# Altium schematic sheet FPGA_MGT.SchDoc
size 420 x 297 mm; SheetNumber: 17; SheetTotal: 18; ModifiedBy: -; CheckedDate: -; Title2: Title 2; DivGrp: WUT ISE; Designer: G.Kasprowicz
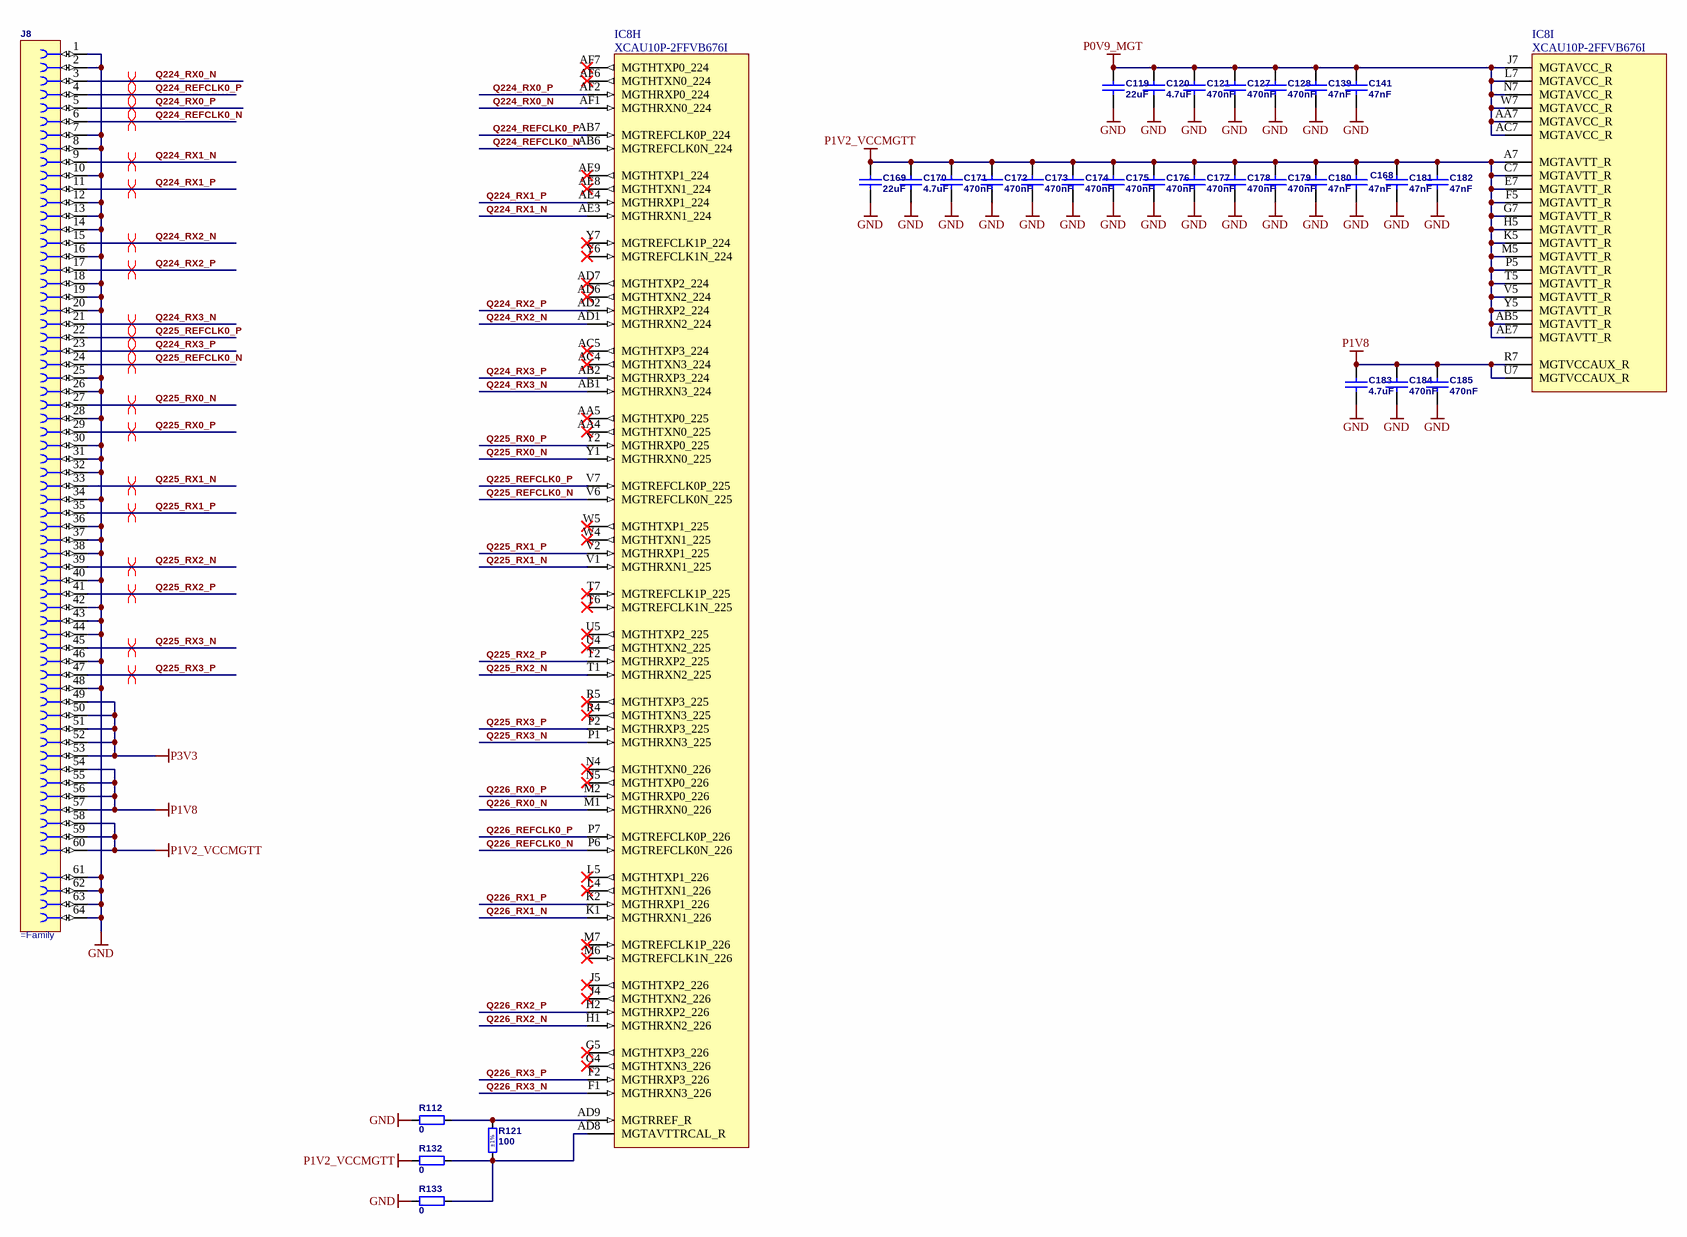
[diagram p0: FPGA_MGT.SchDoc]

## Parts
C119  22uF  [CAPC1608X90N]
C120  4.7uF  [CAPC2012X135N]
C121  470nF  [CAPC1005X55N]
C127  470nF  [CAPC1005X55N]
C128  470nF  [CAPC1005X55N]
C139  47nF  [CAPC1005X55N]
C141  47nF  [CAPC1005X55N]
C168  47nF  [CAPC1005X55N]
C169  22uF  [CAPC1608X90N]
C170  4.7uF  [CAPC2012X135N]
C171  470nF  [CAPC1005X55N]
C172  470nF  [CAPC1005X55N]
C173  470nF  [CAPC1005X55N]
C174  470nF  [CAPC1005X55N]
C175  470nF  [CAPC1005X55N]
C176  470nF  [CAPC1005X55N]
C177  470nF  [CAPC1005X55N]
C178  470nF  [CAPC1005X55N]
C179  470nF  [CAPC1005X55N]
C180  47nF  [CAPC1005X55N]
C181  47nF  [CAPC1005X55N]
C182  47nF  [CAPC1005X55N]
C183  4.7uF  [CAPC2012X135N]
C184  470nF  [CAPC1005X55N]
C185  470nF  [CAPC1005X55N]
IC8  XCAU10P-2FFVB676I  [BGA676C100P26X26_2700X2700X350]  (parts H,I of 13)
J8  (no value)  [SAMTEC_QSH-030-01-L-D-A]
R112  0  [RESC1005X40N]
R121  100  Tolerance: ±1%  [RESC1005X40N]
R132  0  [RESC1005X40N]
R133  0  [RESC1005X40N]

## Nets
GND: C119.1 C120.1 C121.1 C127.1 C128.1 C139.1 C141.1 C168.1 C169.1 C170.1 C171.1 C172.1 C173.1 C174.1 C175.1 C176.1 C177.1 C178.1 C179.1 C180.1 C181.1 C182.1 C183.1 C184.1 C185.1 J8.1 J8.2 J8.7 J8.8 J8.10 J8.12 J8.13 J8.14 J8.16 J8.18 J8.19 J8.20 J8.25 J8.26 J8.28 J8.30 J8.31 J8.32 J8.34 J8.36 J8.37 J8.38 J8.40 J8.42 J8.43 J8.44 J8.46 J8.48 J8.61 J8.62 J8.63 J8.64 R112.1 R133.1
P0V9_MGT: C119.2 C120.2 C121.2 C127.2 C128.2 C139.2 C141.2 IC8.AA7(MGTAVCC_R) IC8.AC7(MGTAVCC_R) IC8.J7(MGTAVCC_R) IC8.L7(MGTAVCC_R) IC8.N7(MGTAVCC_R) IC8.W7(MGTAVCC_R)
P1V2_VCCMGTT: C168.2 C169.2 C170.2 C171.2 C172.2 C173.2 C174.2 C175.2 C176.2 C177.2 C178.2 C179.2 C180.2 C181.2 C182.2 IC8.A7(MGTAVTT_R) IC8.AB5(MGTAVTT_R) IC8.AE7(MGTAVTT_R) IC8.C7(MGTAVTT_R) IC8.E7(MGTAVTT_R) IC8.F5(MGTAVTT_R) IC8.G7(MGTAVTT_R) IC8.H5(MGTAVTT_R) IC8.K5(MGTAVTT_R) IC8.M5(MGTAVTT_R) IC8.P5(MGTAVTT_R) IC8.T5(MGTAVTT_R) IC8.V5(MGTAVTT_R) IC8.Y5(MGTAVTT_R) J8.58 J8.59 J8.60 R132.1
P1V8: C183.2 C184.2 C185.2 IC8.R7(MGTVCCAUX_R) IC8.U7(MGTVCCAUX_R) J8.54 J8.55 J8.56 J8.57
P3V3: J8.49 J8.50 J8.51 J8.52 J8.53
Q224_REFCLK0_N: IC8.AB6(MGTREFCLK0N_224) J8.6
Q224_REFCLK0_P: IC8.AB7(MGTREFCLK0P_224) J8.4
Q224_RX0_N: IC8.AF1(MGTHRXN0_224) J8.3
Q224_RX0_P: IC8.AF2(MGTHRXP0_224) J8.5
Q224_RX1_N: IC8.AE3(MGTHRXN1_224) J8.9
Q224_RX1_P: IC8.AE4(MGTHRXP1_224) J8.11
Q224_RX2_N: IC8.AD1(MGTHRXN2_224) J8.15
Q224_RX2_P: IC8.AD2(MGTHRXP2_224) J8.17
Q224_RX3_N: IC8.AB1(MGTHRXN3_224) J8.21
Q224_RX3_P: IC8.AB2(MGTHRXP3_224) J8.23
Q225_REFCLK0_N: IC8.V6(MGTREFCLK0N_225) J8.24
Q225_REFCLK0_P: IC8.V7(MGTREFCLK0P_225) J8.22
Q225_RX0_N: IC8.Y1(MGTHRXN0_225) J8.27
Q225_RX0_P: IC8.Y2(MGTHRXP0_225) J8.29
Q225_RX1_N: IC8.V1(MGTHRXN1_225) J8.33
Q225_RX1_P: IC8.V2(MGTHRXP1_225) J8.35
Q225_RX2_N: IC8.T1(MGTHRXN2_225) J8.39
Q225_RX2_P: IC8.T2(MGTHRXP2_225) J8.41
Q225_RX3_N: IC8.P1(MGTHRXN3_225) J8.45
Q225_RX3_P: IC8.P2(MGTHRXP3_225) J8.47
Q226_REFCLK0_N: IC8.P6(MGTREFCLK0N_226)
Q226_REFCLK0_P: IC8.P7(MGTREFCLK0P_226)
Q226_RX0_N: IC8.M1(MGTHRXN0_226)
Q226_RX0_P: IC8.M2(MGTHRXP0_226)
Q226_RX1_N: IC8.K1(MGTHRXN1_226)
Q226_RX1_P: IC8.K2(MGTHRXP1_226)
Q226_RX2_N: IC8.H1(MGTHRXN2_226)
Q226_RX2_P: IC8.H2(MGTHRXP2_226)
Q226_RX3_N: IC8.F1(MGTHRXN3_226)
Q226_RX3_P: IC8.F2(MGTHRXP3_226)
NetIC8_AD8: IC8.AD8(MGTAVTTRCAL_R) R121.2 R132.2 R133.2
NetIC8_AD9: IC8.AD9(MGTRREF_R) R112.2 R121.1

Not connected (* = marked no-connect by the designer): IC8 AA4(MGTHTXN0_225)* AA5(MGTHTXP0_225)* AC4(MGTHTXN3_224)* AC5(MGTHTXP3_224)* AD6(MGTHTXN2_224)* AD7(MGTHTXP2_224)* AE8(MGTHTXN1_224)* AE9(MGTHTXP1_224)* AF6(MGTHTXN0_224)* AF7(MGTHTXP0_224)* G4(MGTHTXN3_226)* G5(MGTHTXP3_226)* J4(MGTHTXN2_226)* J5(MGTHTXP2_226)* L4(MGTHTXN1_226)* L5(MGTHTXP1_226)* M6(MGTREFCLK1N_226)* M7(MGTREFCLK1P_226)* N4(MGTHTXN0_226)* N5(MGTHTXP0_226)* R4(MGTHTXN3_225)* R5(MGTHTXP3_225)* T6(MGTREFCLK1N_225)* T7(MGTREFCLK1P_225)* U4(MGTHTXN2_225)* U5(MGTHTXP2_225)* W4(MGTHTXN1_225)* W5(MGTHTXP1_225)* Y6(MGTREFCLK1N_224)* Y7(MGTREFCLK1P_224)*

## Layout directives
differential pair: Q224_REFCLK0_N, Q224_REFCLK0_P, Q224_RX0_N, Q224_RX0_P, Q224_RX1_N, Q224_RX1_P, Q224_RX2_N, Q224_RX2_P, Q224_RX3_N, Q224_RX3_P, Q225_REFCLK0_N, Q225_REFCLK0_P, Q225_RX0_N, Q225_RX0_P, Q225_RX1_N, Q225_RX1_P, Q225_RX2_N, Q225_RX2_P, Q225_RX3_N, Q225_RX3_P

## Notes on the sheet
- Project/Equipment
- Document
- Designer
- Drawn by
- Check.by
- Copyright WUT ISE 2024.
  This documentation describes Open Hardware and is licensed under the CERN OHL v.2. You may redistribute and modify this documentation under the terms of the CERN OHL v.2. (http://ohwr.org/CERNOHL). This documentation is distributed WITHOUT ANY EXPRESS OR IMPLIED WARRANTY, INCLUDING OF MERCHANTABILITY, SATISFACTORY QUALITY AND FITNESS FOR A PARTICULAR PURPOSE. Please see the CERN OHL v.2 for applicable conditions.
- Contact
- File
- Last Mod.
- Print Date
- Sheet
- Size
- A3
- of
- Rev

## Library data of the parts
C119 C169 = CC0603_22UF_6.3V_20%_X5R: Non-polarised capacitor; Part Description: SMD Multilayer Chip Ceramic Capacitor; Manufacturer: GENERIC; Manufacturer1 Part Number: C1608X5R0J226M080; Voltage: 6.3V; TC: X5R; Tolerance: ±20%; Part Number: CC0603_22UF_6.3V_20%_X5R; Component Kind: Standard; Component Type: Standard; Pin Count: 2; Value: 22uF; Status: None; Manufacturer Part Number: CC0603_22UF_6.3V_20%_X5R; Case: 0603; Mounted: Yes; Socket: No; SMD: Yes; Sense: No; Manufacturer1 Example: TDK; Manufacturer1 ComponentHeight: 0.9mm; HelpURL: \\cern.ch\dfs\Applications\Altium\Datasheets\CC0603_X5R_TDK_C.pdf; Author: CERN DEM JLC; CreateDate: 16.12.2013; LatestRevisionDate: 03.12.2020
C120 C170 C183 = CC0805_4.7UF_16V_10%_X7R: Non-polarised capacitor; Part Description: SMD Multilayer Chip Ceramic Capacitor; Manufacturer: GENERIC; Manufacturer1 Part Number: EMK212B7475KG-T; Voltage: 16V; TC: X7R; Tolerance: ±10%; Part Number: CC0805_4.7UF_16V_10%_X7R; Component Kind: Standard; Component Type: Standard; Pin Count: 2; Value: 4.7uF; Status: Preferred; Manufacturer Part Number: CC0805_4.7UF_16V_10%_X7R; Case: 0805; Mounted: Yes; Socket: No; SMD: Yes; Sense: No; Manufacturer1 Example: TAIYO YUDEN; Manufacturer1 ComponentHeight: 1.35mm; HelpURL: \\cern.ch\dfs\Applications\Altium\Datasheets\CC0805_X7R_TAIYO-YUDEN_HIGH-VALUE.pdf; Author: CERN DEM JLC; CreateDate: 16.09.2014; LatestRevisionDate: 16.09.2014
C121 C127 C128 C171-C179 C184 C185 = CC0402_470NF_16V_10%_X5R: Non-polarised capacitor; Part Description: SMD Multilayer Chip Ceramic Capacitor; Manufacturer: GENERIC; Manufacturer1 Part Number: C1005X5R1C105KT; Voltage: 16V; TC: X5R; Tolerance: ±10%; Part Number: CC0402_470NF_16V_10%_X5R; Component Kind: Standard; Component Type: Standard; Pin Count: 2; Value: 470nF; Status: Preferred; Manufacturer Part Number: CC0402_470NF_16V_10%_X5R; Case: 0402; Mounted: Yes; Socket: No; SMD: Yes; Sense: No; Manufacturer1 Example: TDK; Manufacturer1 ComponentHeight: 0.55mm; HelpURL: \\cern.ch\dfs\Applications\Altium\Datasheets\CC0402_X5R_TDK_C.pdf; Author: CERN DEM JLC; CreateDate: 25.10.2012; LatestRevisionDate: 25.10.2012
C139 C141 C168 C180-C182 = CC0402_47NF_16V_10%_X7R: Non-polarised capacitor; Part Description: SMD Multilayer Chip Ceramic Capacitor; Manufacturer: GENERIC; Manufacturer1 Part Number: 223878715645; Voltage: 16V; TC: X7R; Tolerance: ±10%; Part Number: CC0402_47NF_16V_10%_X7R; Component Kind: Standard; Component Type: Standard; Pin Count: 2; Value: 47nF; Status: Not Recommended; Manufacturer Part Number: CC0402_47NF_16V_10%_X7R; Case: 0402; Mounted: Yes; Socket: No; SMD: Yes; Sense: No; Manufacturer1 Example: PHYCOMP; Manufacturer1 ComponentHeight: 0.55mm; HelpURL: \\cern.ch\dfs\Applications\Altium\Datasheets\CC0402_X7R_PHYCOMP.pdf; Author: CERN DEM JLC; CreateDate: 03.12.2007; LatestRevisionDate: 03.12.2007
IC8 = XCAU10P-2FFVB676I: Artix UltraScale + Field Programmable Gate Array (FPGA), 676-Pin BGA, Industrial Grade; Manufacturer: AMD; PressFit: No; Bonding: No; Part Number: XCAU10P-2FFVB676I; Component Kind: Standard; Component Type: Standard; Device: XCAU10P-2FFVB676I; PackageDescription: BGA, 1.00mm Pitch, Square; 672 Pin, 26 Columns X 26 Rows, Body 27.00mm X 27.00mm X 3.50mm H, IPC Medium Density; Part Description: Artix UltraScale + Field Programmable Gate Array (FPGA), 676-Pin BGA, Industrial Grade; Manufacturer Part Number: XCAU10P-2FFVB676I; Pin Count: 676; Case: BGA676; Mounted: Yes; Socket: No; SMD: Yes; Sense: No; ComponentHeight: 3.50mm; HelpURL: \\cern.ch\dfs\Applications\Altium\Datasheets\XCAU10P-2FFVB676I.pdf; ComponentLink1URL: \\cern.ch\dfs\Applications\Altium\Datasheets\XCAU10P-2FFVB676I_Package.pdf; ComponentLink1Description: Package Drawing; ComponentLink2URL: \\cern.ch\dfs\Applications\Altium\Datasheets\XCAU10P-2FFVB676I_Pinout.pdf; ComponentLink2Description: Pinout; Author: CERN DEM HF; CreateDate: 10.02.2025; LatestRevisionDate: 10.02.2025
J8 = SAMTEC_QSH-030-01-L-D-A: Connector 60 Female + 4 GND; Part Description: 60 Contacts (2x30) , Pitch 0.5mm, Straight Double Row High Speed Ground Plane Socket; Manufacturer: SAMTEC; PressFit: No; Part Number: SAMTEC_QSH-030-01-L-D-A; Component Kind: Standard; Component Type: Standard; Pin Count: 64; Mounted: Yes; Socket: No; SMD: Yes; Sense: No; Status: None; Manufacturer Part Number: QSH-030-01-L-D-A; ComponentHeight: 3.25mm; HelpURL: \\cern.ch\dfs\Applications\Altium\Datasheets\SAMTEC_QSH-030-01-L-D-A.pdf; Author: CERN DEM JLC; CreateDate: 07.10.2013; LatestRevisionDate: 07.10.2013
R112 R132 R133 = R0402_0R_JUMPER: Resistor; Part Description: 1A (0.05R Max DC Resistance) Zero Ohm Jumper; Manufacturer: GENERIC; Manufacturer1 Part Number: 232270591001L; PressFit: No; Part Number: R0402_0R_JUMPER; Component Kind: Standard; Component Type: Standard; Pin Count: 2; Value: 0; Status: Not Recommended; Manufacturer Part Number: R0402_0R_JUMPER; Case: 0402; Mounted: Yes; Sense: No; Socket: No; SMD: Yes; Manufacturer1 Example: YAGEO PHYCOMP; Manufacturer1 ComponentHeight: 0.4mm; HelpURL: \\cern.ch\dfs\Applications\Altium\Datasheets\R0402_Phycomp_RC0402.pdf; Author: CERN DEM JLC; CreateDate: 03.12.2007; LatestRevisionDate: 17.10.2012
R121 = R0402_100R_1%_0.0625W_100PPM: Resistor - 1%; Part Description: General Purpose Thick Film Chip Resistor; Manufacturer: GENERIC; Manufacturer1 Part Number: 232270671001L; TC: ±100ppm/°C; PressFit: No; Part Number: R0402_100R_1%_0.0625W_100PPM; Component Kind: Standard; Component Type: Standard; Pin Count: 2; Value: 100; Status: Not Recommended; Power: 0.0625W; Manufacturer Part Number: R0402_100R_1%_0.0625W_100PPM; Case: 0402; Mounted: Yes; Sense: No; Socket: No; SMD: Yes; Manufacturer1 Example: YAGEO PHYCOMP; Manufacturer1 ComponentHeight: 0.4mm; HelpURL: \\cern.ch\dfs\Applications\Altium\Datasheets\R0402_Phycomp_RC0402.pdf; Author: CERN DEM JLC; CreateDate: 03.12.2007; LatestRevisionDate: 17.10.2012